# Altium project Handheld Receiver.PrjPCB
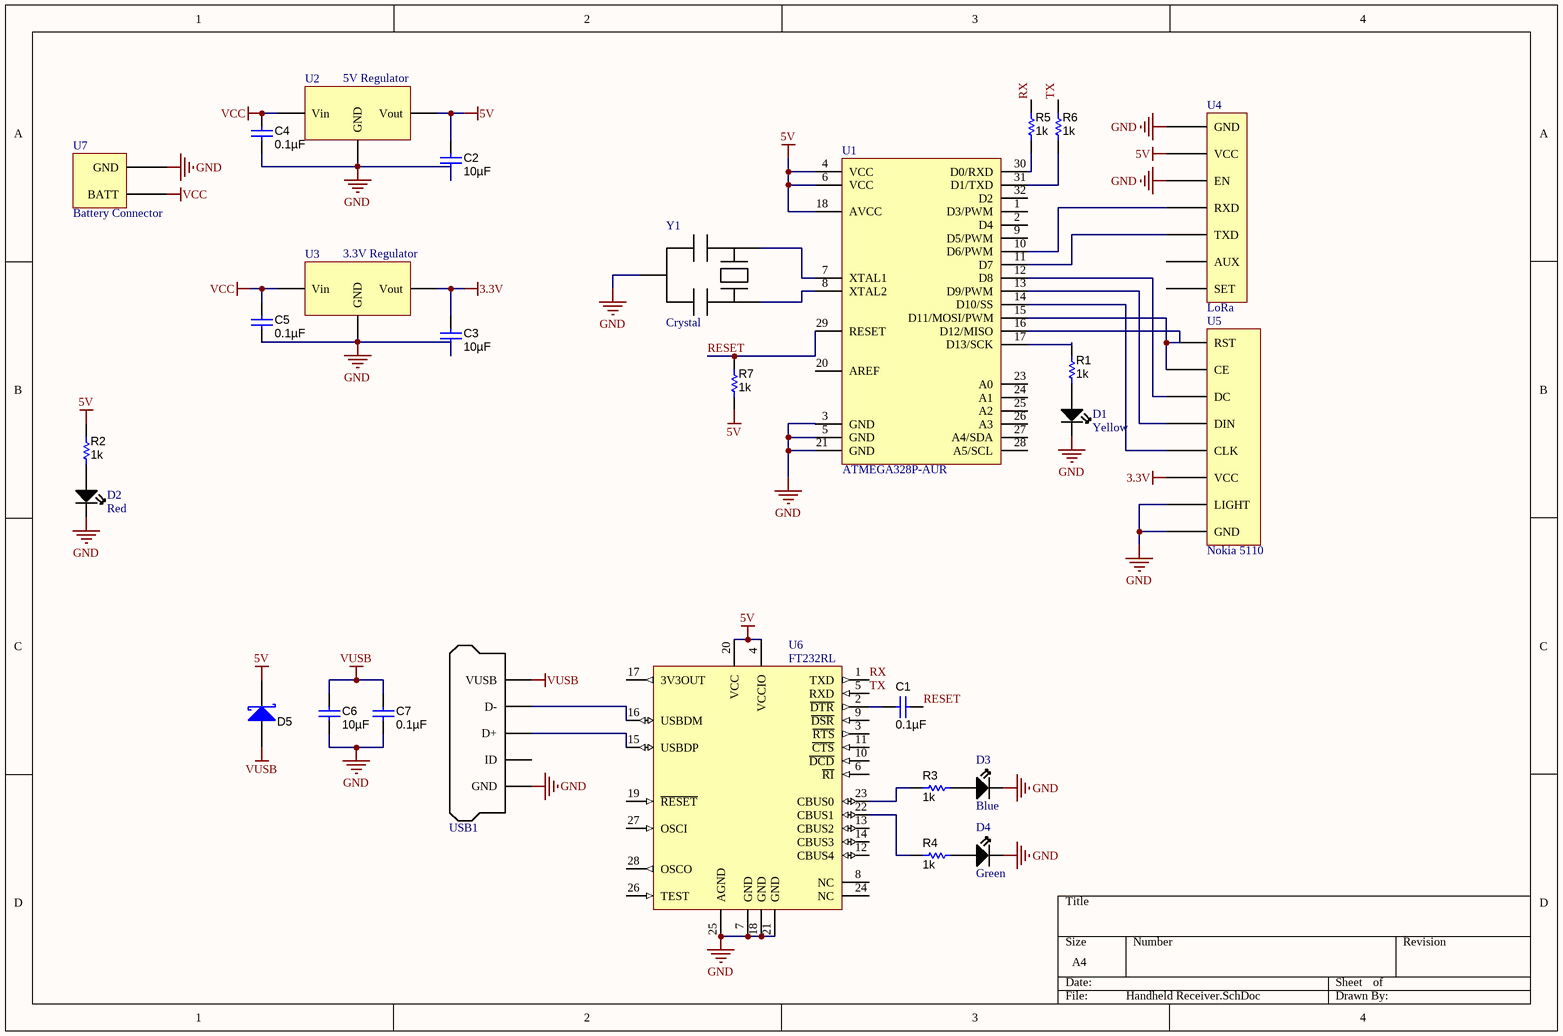
[diagram p0: Handheld Receiver.SchDoc]
1 sheet, 28 parts. Net scope: global (net labels, ports and power ports of the same name join across sheets).
Board file: Handheld Receiver.PcbDoc

## Sheet Handheld Receiver.SchDoc
size A4

### Parts
C1  0.1µF  [0402]
C2  10µF  [CAP-0603]
C3  10µF  [CAP-0603]
C4  0.1µF  [CAP-0603]
C5  0.1µF  [CAP-0603]
C6  10µF  [CAP-0603]
C7  0.1µF  [CAP-0603]
D1  Yellow  [LED 0603 Red]
D2  Red  [LED 0603 Red]
D3  Blue  [LED 0603 Red]
D4  Green  [LED 0603 Red]
D5  1N5819HW-7-F  [SOD-123]  (value not drawn)
R1  1k  [0402]
R2  1k  [0402]
R3  1k  [0402]
R4  1k  [0402]
R5  1k  [0402]
R6  1k  [0402]
R7  1k  [0402]
U1  ATMEGA328P-AUR  [TQFP32]
U2  5V Regulator  [SOT233]
U3  3.3V Regulator  [SOT233]
U4  LoRa  [DRF1278DM]
U5  Nokia 5110  [NOKIA5110]
U6  FT232RL  [SSOP-28_N]
U7  Battery Connector  [BATTERY_PADS]
USB1  USB connector  [USB MICRO-B]  (value not drawn)
Y1  Crystal  [CSTCE]

### Nets
3.3V: C3.1 U3.2(Vout) U5.3(VCC)
5V: C2.1 D5.1(K) R2.2 R7.1 U1.4(VCC) U1.6(VCC) U1.18(AVCC) U2.2(Vout) U4.6(VCC) U6.4(VCCIO) U6.20(VCC)
GND: C2.2 C3.2 C4.2 C5.2 C6.2 C7.2 D1.2(Cathode) D2.2(Cathode) D3.2(Cathode) D4.2(Cathode) U1.3(GND) U1.5(GND) U1.21(GND) U2.1(GND) U3.1(GND) U4.5(EN) U4.7(GND) U5.1(GND) U5.2(LIGHT) U6.7(GND) U6.18(GND) U6.21(GND) U6.25(AGND) U7.2(GND) USB1.5(GND) Y1.1
VCC: C4.1 C5.1 U2.3(Vin) U3.3(Vin) U7.1(BATT)
VUSB: C6.1 C7.1 D5.2(A) USB1.1(VUSB)
RESET: C1.1 R7.2 U1.29(RESET)
RX: R5.2 U6.1(TXD)
TX: R6.2 U6.5(RXD)
NetC1_2: C1.2 U6.2(~{DTR})
NetD1_1: D1.1(Anode) R1.2
NetD2_1: D2.1(Anode) R2.1
NetD3_1: D3.1(Anode) R3.1
NetD4_1: D4.1(Anode) R4.1
NetR1_1: R1.1 U1.17(D13/SCK)
NetR3_2: R3.2 U6.23(CBUS0)
NetR4_2: R4.2 U6.22(CBUS1)
NetR5_1: R5.1 U1.30(D0/RXD)
NetR6_1: R6.1 U1.31(D1/TXD)
NetU1_7: U1.7(XTAL1) Y1.2
NetU1_8: U1.8(XTAL2) Y1.3
NetU1_10: U1.10(D6/PWM) U4.4(RXD)
NetU1_11: U1.11(D7) U4.3(TXD)
NetU1_12: U1.12(D8) U5.6(DC)
NetU1_13: U1.13(D9/PWM) U5.5(DIN)
NetU1_14: U1.14(D10/SS) U5.4(CLK)
NetU1_15: U1.15(D11/MOSI/PWM) U1.16(D12/MISO) U5.7(CE) U5.8(RST)
NetU6_15: U6.15(USBDP) USB1.3(D+)
NetU6_16: U6.16(USBDM) USB1.2(D-)

Not connected (* = marked no-connect by the designer): U1 1(D3/PWM) 2(D4) 9(D5/PWM) 20(AREF) 23(A0) 24(A1) 25(A2) 26(A3) 27(A4/SDA) 28(A5/SCL) 32(D2); U2 4(GND); U3 4(GND); U4 1(SET) 2(AUX); U6 3(~{RTS}) 6(~{RI}) 8(NC) 9(~{DSR}) 10(~{DCD}) 11(~{CTS}) 12(CBUS4) 13(CBUS2) 14(CBUS3) 17(3V3OUT) 19(~{RESET}) 24(NC) 26(TEST) 27(OSCI) 28(OSCO); USB1 4(ID)

### Library data of the parts
C1-C7 = Capacitor: CAP
  C1 C4 C5 C7: Value: 0.1µF
  C2 C3 C6: Value: 10µF
D1-D4 = LED
  D1: Color: Yellow
  D2: Color: Red
  D3: Color: Blue
  D4: Color: Green
D5 = 1N5819HW-7-F: Diode, Schottky, 40V, 1A, SOD-123; Manufacturer: Diodes Inc.; U/M: EA; Vf_V: 0.45; Value2: 0.45V; Io_A: 1; Vr_V: 40; TJmax_C: 125; CompType: Diode; SymbolVersion: 2008-12-08; PartNumber: 1N5819HW-7-F; PackageReference: SOD-123; MountType: SMT; Type: Schottky; RoHS: Y; Published: 2008-06-26; Publisher: Texas Instruments; LatestRevisionDate: 2013-07-17; ComponentLink1Description: Datasheet link; ComponentLink1URL: http://www.diodes.com/datasheets/ds30217.pdf; Supplier 1: Digi-Key; Supplier Part Number 1: 1N5819HW-FDICT-ND; Supplier 2: Mouser; Supplier Part Number 2: 621-1N5819HW-F; Supplier 3: Farnell; Supplier Part Number 3: 1773475; Value: 40V; Value1: 1A
R1-R7 = Resistor: Value: 1k
U1 = ATmega328P-AU: 8-bit AVR Microcontroller, 32KB Flash, 1KB EEPROM, 2KB SRAM, 32-pin TQFP, Industrial Grade (-40°C to 85°C); Manufacturer: Atmel; Speed: 20MHz; Connectivity: I²C, SPI, UART/USART; Peripherals: Brown-out Detect/Reset, POR, PWM, WDT; Number of I/O: 23; Program Memory Size: 32KB (16K x 16); EEPROM Size: 1K x 8; RAM Size: 2K x 8; Voltage - Supply (Vcc/Vdd): 1.8 V ~ 5.5 V; Data Converters: A/D 8x10b; Oscillator Type: Internal; Published: 1-Apr-2010; DatasheetVersion: revA, Jan-2010; PackageVersion: revB, Oct-2001; PackageReference: 32A; Publisher: Altium Limited; PackageDescription: 32-Lead, 7x7x1.0 mm Body, 0.8mm Lead Pitch, Thin Profile Plastic Quad Flat Package (TQFP); Supplier 1: Digi-Key; Supplier Part Number 1: ATMEGA328P-AU-ND; Supplier 2: Farnell; Supplier Part Number 2: 1715486; Supplier 3: Mouser; Supplier Part Number 3: 556-ATMEGA328P-AU; Code_JEDEC: MS-026-ABA; ComponentLink1Description: Manufacturer Link; ComponentLink1URL: http://www.atmel.com/products/avr/default.asp?; ComponentLink2Description: ATmega48A/48PA/88A/88PA/168A/168PA/328/328P Datasheet; ComponentLink2URL: http://www.atmel.com/dyn/resources/prod_documents/8271.pdf; ComponentLink3Description: ATmega48A/48PA/88A/88PA/168A/168PA/328/328P Summary; ComponentLink3URL: http://www.atmel.com/dyn/resources/prod_documents/8271S.pdf; ComponentLink4Description: Atmel.com Home; ComponentLink4URL: http://www.atmel.com; Supplier 4: Digi-Key; RoHS: RoHS Compliant; Category: Integrated Circuits (ICs); Stock 4: 7031; Pricing 4: 1=3.7, 10=3.305, 25=2.9748, 100=2.7103, 250=2.44588, 500=2.19468, 1000=1.85094 (USD); Packaging: Cut Tape (CT); Core Processor: AVR; Core Size: 8-Bit; Program Memory Type: FLASH; Operating Temperature: -40°C ~ 85°C; Package / Case: 32-TQFP; Supplier Device Package: 32-TQFP (7x7); ComponentLink5URL: http://www.atmel.com/images/atmel-8271-8-bit-avr-microcontroller-atmega48a-48pa-88a-88pa-168a-168pa-328-328p_datasheet_summary.pdf; ComponentLink5Description: http://www.atmel.com/images/atmel-8271-8-bit-avr-microcontroller-atmega48a-48pa-88a-88pa-168a-168pa-328-328p_datasheet_summary.pdf; Supplier Part Number 4: ATMEGA328P-AURCT-ND; Manufacturer Part Number: ATMEGA328P-AUR
U2 U3 = SOT223-REG: SOT223 regulator
U4 = DRF1278DM: LoRa module
U5 = Nokia 5110: Nokia 5110 LCD module
U6 = FT232RL-Reel: USB UART Asynchronous Serial Data Transfer Chip, SSOP-28, Tape and Reel; Published: 19-Aug-2010; DatasheetVersion: ver 2.07, Jul-2010; PackageVersion: 2010; PackageReference: SSOP-28; Publisher: Altium Limited; PackageDescription: 28-Pin Small Outline Package 0.65 mm Pitch; ComponentLink1Description: Manufacturer Link; ComponentLink1URL: http://www.ftdichip.com/Products/ICs/FT232R.htm; ComponentLink2Description: Datasheet; ComponentLink2URL: http://www.ftdichip.com/Support/Documents/DataSheets/ICs/DS_FT232R.pdf
Y1 = Crystal: 16Mhz; Datasheet: http://www.farnell.com/datasheets/1888758.pdf; Source: http://ee.farnell.com/murata/cstce16m0v53z-r0/resonator-ceramic-16mhz-smd/dp/2470359; Datasheet2: http://www.murata.com/~/media/webrenewal/support/library/catalog/products/timingdevice/ceralock/p17e.ashx
USB1 = USB connector: Farnell: http://ee.farnell.com/fci/10103594-0001lf/micro-usb-2-0-type-b-recetpacle/dp/2293752?ost=FCI+10103594-0001LF